# EAGLE design ai_breakout_ds1307 (EAGLE 7.1.0)
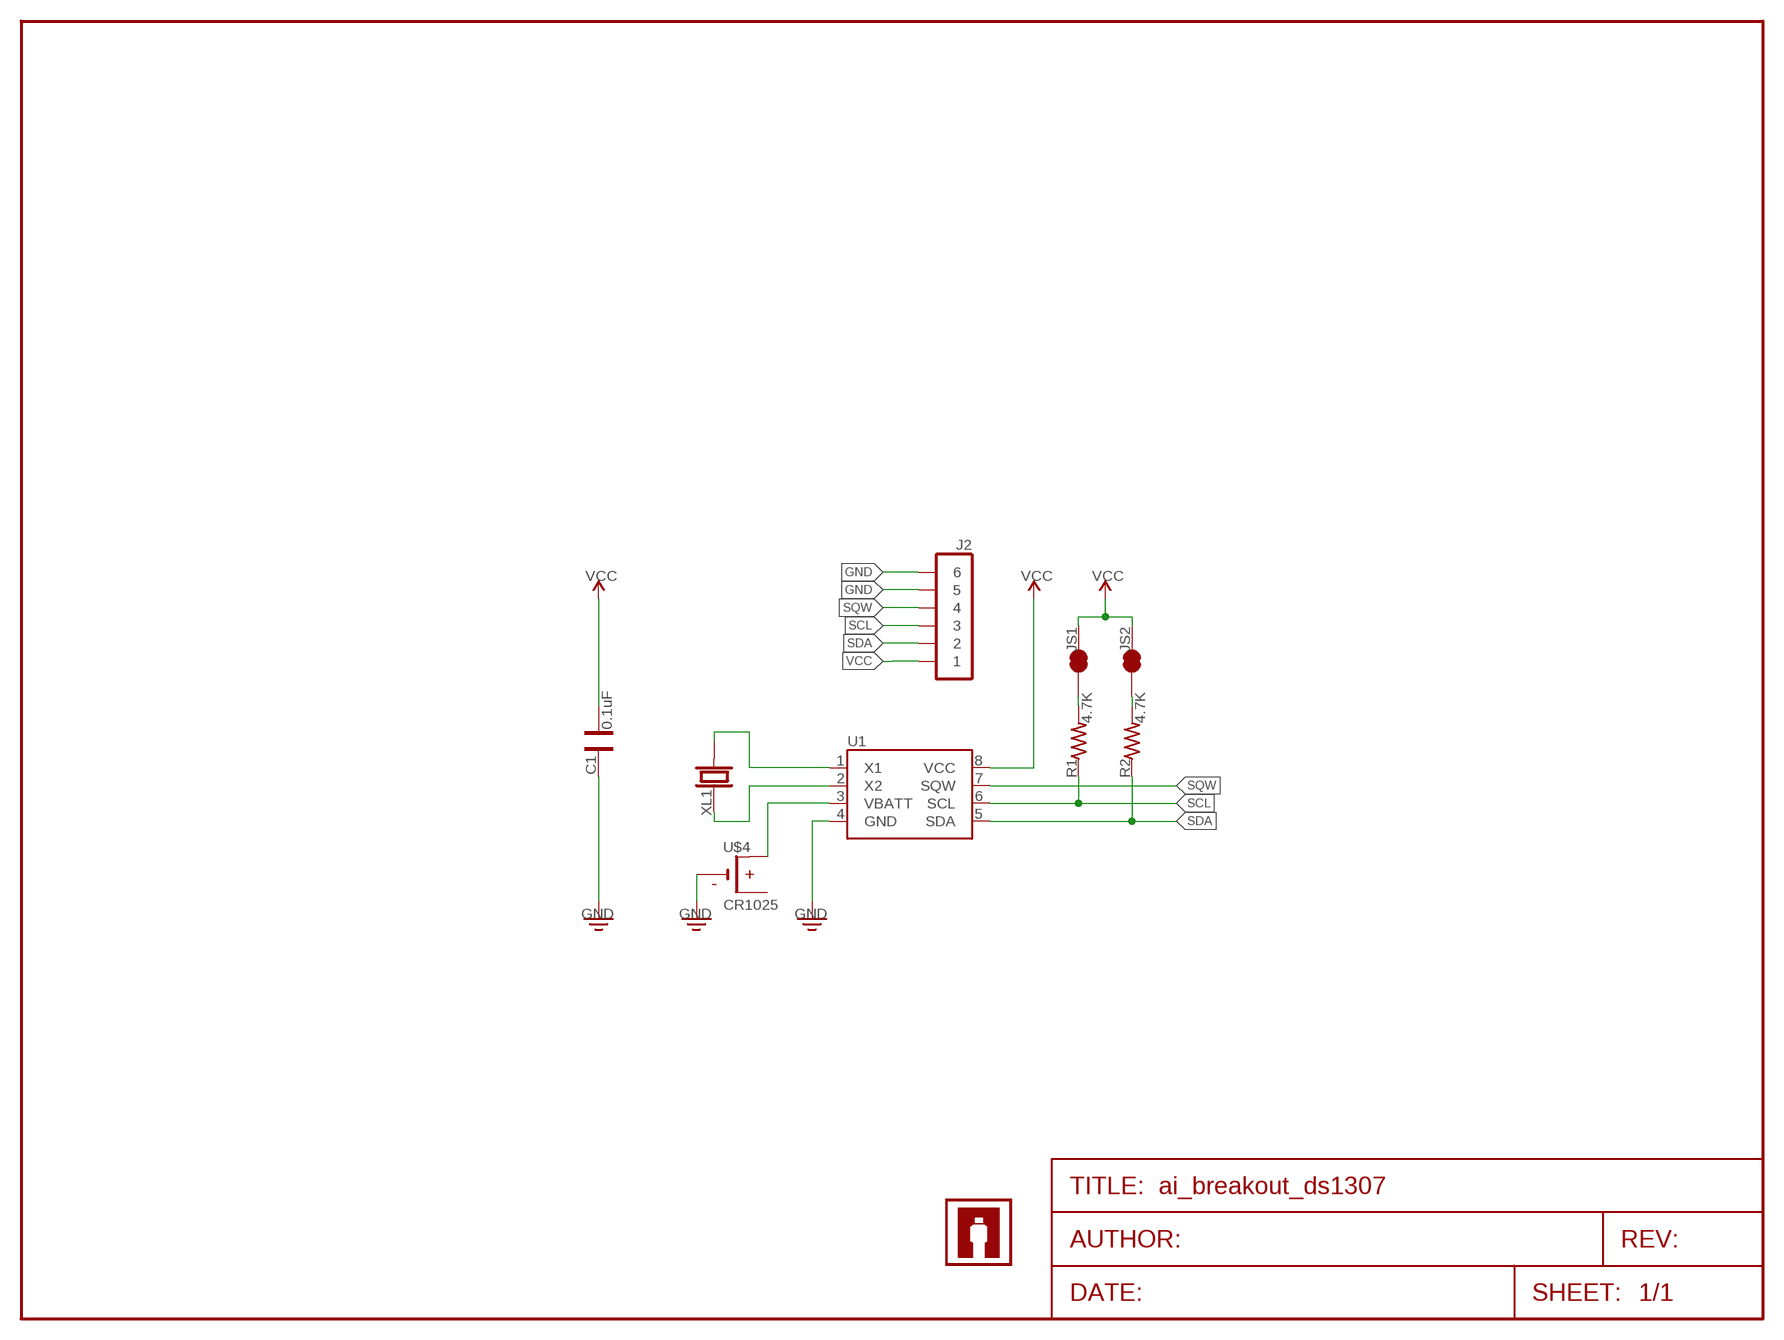
[diagram p0: schematic, sheet 1]

## Parts
C1  0.1uF  CAP0603  [CAP-0603]
J2  1X06  [1X06]
JS1  1X02-SJ-NCT  [1X02-SJ-NCT]
JS2  1X02-SJ-NCT  [1X02-SJ-NCT]
R1  4.7K  RES0603  [RES-0603]
R2  4.7K  RES0603  [RES-0603]
U1  DS1307SO8  [SO08]
U$3  AI-LOGOXS  [AI-LOGO-XS]
U$4  CR1025  [CR1025-SMD]
XL1  CRYSTALCYL-2X6MM-SMT  [CRYSTAL-CYL-2X6MM-SMT]

## Nets
GND: C1.2 J2.5 J2.6 U1.4(GND) U$4.-
N$1: JS1.1 R1.2
N$2: JS2.1 R2.2
N$3: U1.3(VBATT) U$4.+@1(+1) U$4.+@2(+1)
N$5: U1.2(X2) XL1.1
N$6: U1.1(X1) XL1.2
SCL: J2.3 R1.1 U1.6(SCL)
SDA: J2.2 R2.1 U1.5(SDA)
SQW: J2.4 U1.7(SQW)
VCC: C1.1 J2.1 JS1.2 JS2.2 U1.8(VCC)

## Library data of the parts
C1 = Ai_Passives:CAP
J2 = Ai_Connectors:1X06
JS1 JS2 = Ai_Connectors:1X02-SJ-NC
R1 R2 = Ai_Passives:RES: Part # blah Digikey
U1 = Ai_IC:DS1307
U$3 = Ai_Miscellany:AI-LOGO
U$4 = Ai_Connectors:CR1025
XL1 = Ai_FrequencyControl:CRYSTAL: Cylinder: CMR200T-32.768KDZBT

## Board
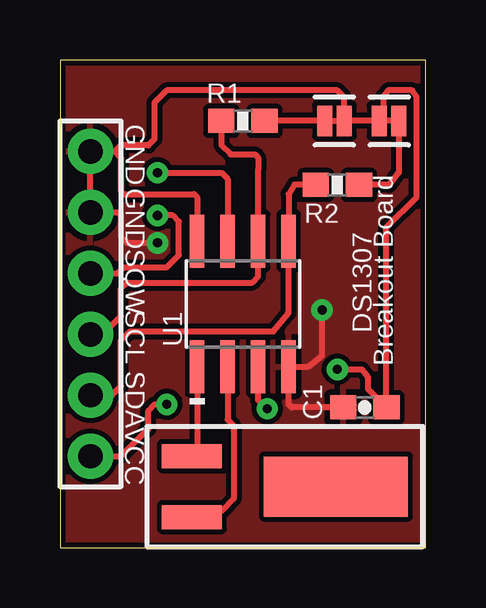
[diagram p1: board, top side]
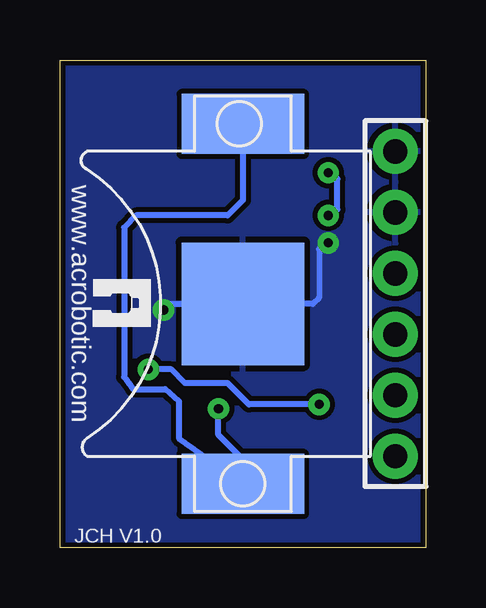
[diagram p2: board, bottom side, seen from below]

Size 15.24 x 20.32 mm. Coordinates in mm from the lower left corner, seen from the top.
Outline: 0,0 15.24,0 15.24,20.32 0,20.32 0,0
Copper layers (1*16): Top 0.035mm / dielectric 1.5mm / Bottom 0.035mm
Design rules "ai_2layer_qfn": minimum track width 7mil, minimum drill 15mil, track to track 8mil, track to pad 8mil, pad to pad 8mil, via to via 8mil, smd to smd 8mil, copper to edge 8mil, drill to drill 8mil, minimum pad ring 1mil, minimum via ring 10mil, stop-mask expansion 4mil, vias tented up to drill 20mil, thermal gap 10mil

### Footprints (pad centres in the part's own frame; a part is rotated, then mirrored left to right if it is on the bottom)
CAP-0603 = smd 1.1 x 1: 1 -0.9,0; 2 0.9,0
1X06 = drill 1.016 pad 1.88: 1 -6.35,0; 2 -3.81,0; 3 -1.27,0; 4 1.27,0; 5 3.81,0; 6 6.35,0
1X02-SJ-NCT = smd 0.635 x 1.27: 1 -0.401,0; 2 0.413,0
RES-0603 = smd 1.1 x 1: 1 -0.9,0; 2 0.9,0
SO08 = smd 0.61 x 2.21: 1 -1.905,-2.616; 2 -0.635,-2.616; 3 0.635,-2.616; 4 1.905,-2.616; 5 1.905,2.616; 6 0.635,2.616; 7 -0.635,2.616; 8 -1.905,2.616
CR1025-SMD = smd 2.5 x 5.1: +@1 -7.5,0; +@2 7.5,0 | smd 5.1 x 5.1: - 0,0
CRYSTAL-CYL-2X6MM-SMT = smd 2.5 x 1: 1 2.125,1.27; 2 2.125,-1.27 | smd 6 x 2.5: CYLINDER -3.875,0

### Placement (x,y rotation side)
C1  12.7,5.84 180 top
J2  1.27,10.16 90 top
JS1  11.43,17.78 0 top
JS2  13.72,17.78 180 top
R1  7.62,17.78 0 top
R2  11.56,15.11 0 top
U1  7.62,10.16 0 top
U$3  13.84,11.18 270 bottom
U$4  7.62,10.16 90 bottom
XL1  7.62,2.54 180 top

### Tracks (layer width: path | path; a pad name or v marks a point on that pad's centre or on a via)
GND  (via drill 0.38)
  Top 0.254: C1.2 9.65,5.84 9.53,5.97 U1.4 10.34,7.54 10.92,8 v10.92,9.91 | v4.06,12.7 2.79,12.7 2.54,12.95 2.54,13.84 2.41,13.97 J2.5 J2.6
  Bottom 0.254: v4.06,12.7 4.32,12.7 4.45,12.45 4.45,10.41 4.7,10.16 U$4.- 10.79,10.16 10.92,10.03 v10.92,9.91
  pour Top: 0,0 0,20.32 15.24,20.32 15.24,0
  pour Bottom: 0,0 0,20.32 15.24,20.32 15.24,0
N$1
  Top 0.254: JS1.1 R1.2
N$2
  Top 0.254: JS2.1 14.12,15.64 13.72,15.11 R2.2
N$3  (via drill 0.38)
  Top 0.254: v8.64,5.79 8.38,6.02 8.26,6.15 U1.3
  Bottom 0.254: v8.64,5.79 8.64,4.7 7.62,3.68 U$4.+@1 10.29,4.57 10.29,6.1 10.86,6.6 12.19,6.6 12.57,7.11 12.57,13.34 12.06,13.84 8.26,13.84 7.62,14.48 U$4.+@2
N$5
  Top 0.254: U1.2 6.99,5.33 7.24,5.08 7.24,2.03 6.73,1.52 5.75,1.52 XL1.1
N$6
  Top 0.254: U1.1 5.71,4.03 XL1.2
SCL
  Top 0.254: R1.1 6.72,17.28 6.72,16.77 7.11,16.38 8.13,16.38 8.26,16.26 8.26,15.75 U1.6 8.26,11.3 8,11.05 2.79,11.05 2.54,10.79 2.54,9.65 1.78,8.89 J2.3
SDA
  Top 0.254: R2.1 9.77,15.12 9.53,14.73 U1.5 9.53,9.78 8.89,9.02 2.92,9.02 2.54,8.64 2.54,6.73 2.16,6.35 J2.2
SQW  (via drill 0.38)
  Top 0.254: J2.4 2.41,11.43 2.67,11.68 4.45,11.68 4.95,12.19 4.95,13.59 4.7,13.84 v4.06,13.84 | v4.06,15.62 6.73,15.62 6.99,15.37 U1.7
  Bottom 0.254: v4.06,13.84 3.68,14.1 3.68,15.37 v4.06,15.62
VCC  (via drill 0.38)
  Top 0.254: U1.8 5.71,14.61 5.59,14.73 2.67,14.73 2.54,14.86 2.54,16.26 2.29,16.51 2.54,16.76 3.68,16.76 3.94,17.02 3.94,18.54 4.45,19.05 11.56,19.05 11.84,18.76 JS1.2 JS2.2 13.46,17.62 13.46,18.8 13.66,19.05 14.68,19.05 14.86,18.8 14.86,14.61 13.6,13.35 C1.1 12.83,6.62 12.83,7.11 12.57,7.43 v11.56,7.43 | J2.1 2.54,3.81 3.68,4.95 3.68,5.71 3.94,5.97 v4.45,5.97
  Bottom 0.254: v4.45,5.97 7.37,5.97 8.26,6.86 10.03,6.86 10.6,7.43 v11.56,7.43

### Text on the board
tPlace: Breakout Board | DS1307
tNames: GND | GND | SQW | SCL | SDA | VCC
bNames: www.acrobotic.com | JCH V1.0